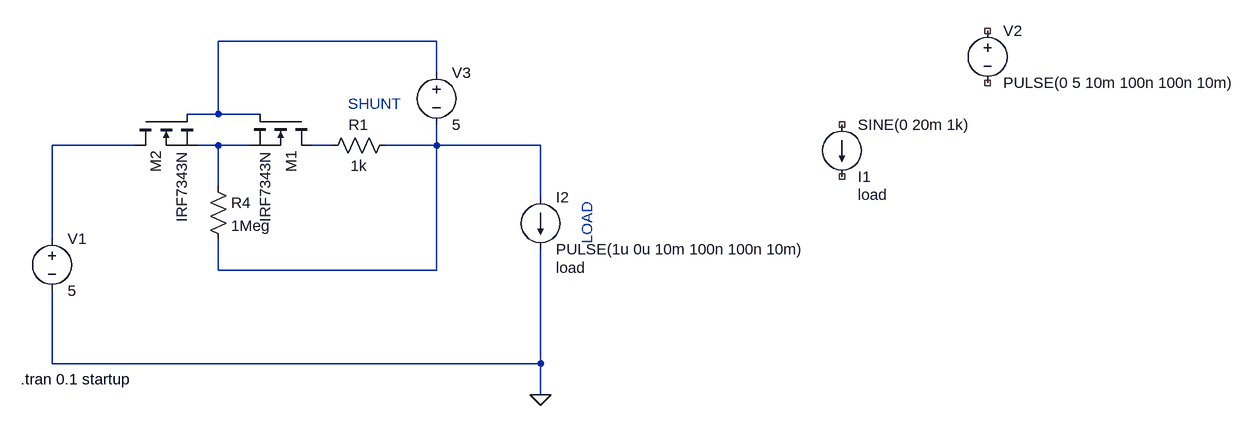
[diagram p0: schematic bidirectional_fet_switch.asc]
bidirectional_fet_switch.asc, the LTspice schematic file:
Version 4
SHEET 1 2020 680
WIRE 768 -160 432 -160
WIRE 768 -112 768 -160
WIRE 432 -48 432 -160
WIRE 432 -48 384 -48
WIRE 496 -48 432 -48
WIRE 304 0 176 0
WIRE 432 0 400 0
WIRE 480 0 432 0
WIRE 608 0 576 0
WIRE 768 0 768 -32
WIRE 768 0 688 0
WIRE 928 0 768 0
WIRE 432 64 432 0
WIRE 928 80 928 0
WIRE 176 144 176 0
WIRE 432 192 432 144
WIRE 768 192 768 0
WIRE 768 192 432 192
WIRE 176 336 176 224
WIRE 928 336 928 160
WIRE 928 336 176 336
WIRE 928 384 928 336
FLAG 928 384 0
SYMBOL voltage 176 128 R0
WINDOW 123 0 0 Left 0
WINDOW 39 0 0 Left 0
SYMATTR InstName V1
SYMATTR Value 5
SYMBOL nmos 576 -48 R90
SYMATTR InstName M1
SYMATTR Value IRF7343N
SYMBOL nmos 304 -48 M90
SYMATTR InstName M2
SYMATTR Value IRF7343N
SYMBOL res 704 -16 R90
WINDOW 0 0 56 VBottom 2
WINDOW 3 32 56 VTop 2
SYMATTR InstName R1
SYMATTR Value 1k
SYMBOL voltage 768 -128 R0
WINDOW 123 0 0 Left 0
WINDOW 39 0 0 Left 0
SYMATTR InstName V3
SYMATTR Value 5
SYMBOL current 1392 -32 R0
WINDOW 0 24 80 Left 2
WINDOW 3 24 0 Left 2
WINDOW 123 0 0 Left 0
WINDOW 39 24 108 Left 2
SYMATTR InstName I1
SYMATTR Value SINE(0 20m 1k)
SYMATTR SpiceLine load
SYMBOL res 416 48 R0
SYMATTR InstName R4
SYMATTR Value 1Meg
SYMBOL current 928 80 R0
WINDOW 123 0 0 Left 0
WINDOW 39 24 108 Left 2
SYMATTR InstName I2
SYMATTR Value PULSE(1u 0u 10m 100n 100n 10m)
SYMATTR SpiceLine load
SYMBOL voltage 1616 -192 R0
WINDOW 123 0 0 Left 0
WINDOW 39 0 0 Left 0
SYMATTR InstName V2
SYMATTR Value PULSE(0 5 10m 100n 100n 10m)
TEXT 128 360 Left 2 !.tran 0.1 startup
TEXT 632 -64 Left 2 ;SHUNT
TEXT 1000 152 VLeft 2 ;LOAD

The netlist it stands for:
* bidirectional_fet_switch.asc
V1 N002 0 5
M1 N004 N001 N003 N003 IRF7343N
M2 N002 N001 N003 N003 IRF7343N
R1 N005 N004 1k
V3 N001 N005 5
I1 NC_01 NC_02 SINE(0 20m 1k) load
R4 N003 N005 1Meg
I2 N005 0 PULSE(1u 0u 10m 100n 100n 10m) load
V2 NC_03 NC_04 PULSE(0 5 10m 100n 100n 10m)
.model NMOS NMOS
.model PMOS PMOS
.lib standard.mos
.tran 0.1 startup
* SHUNT
* LOAD
.backanno
.end